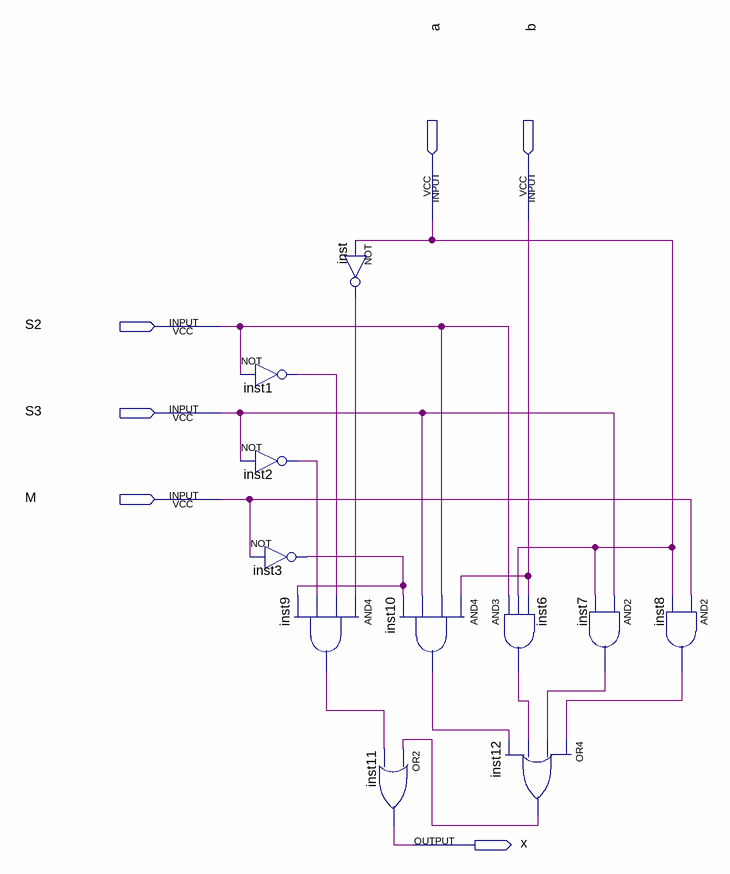
[diagram p0: schematic sheet]
// Quartus schematic logicExtender.bdf as structural Verilog: 11 symbols, 6 pins
module logicExtender (
  input  a,
  input  b,
  input  S2,
  input  S3,
  input  M,
  output x
);

  wire inst1_out, inst2_out, inst3_out, inst6_out, inst7_out, inst8_out, inst9_out, inst10_out, inst12_out,
       inst_out;

  not inst1 (inst1_out, S2);
  not inst2 (inst2_out, S3);
  not inst3 (inst3_out, M);
  and inst9 (inst9_out, inst_out, inst1_out, inst2_out, inst3_out);
  not inst (inst_out, a);
  and inst10 (inst10_out, b, S2, S3, inst3_out);
  or inst11 (x, inst12_out, inst9_out);
  and inst6 (inst6_out, S2, a, b);
  or inst12 (inst12_out, inst8_out, inst7_out, inst6_out, inst10_out);
  and inst7 (inst7_out, S3, a);
  and inst8 (inst8_out, M, a);
endmodule
